# EAGLE design mainboard_200305 (EAGLE 7.7.0)
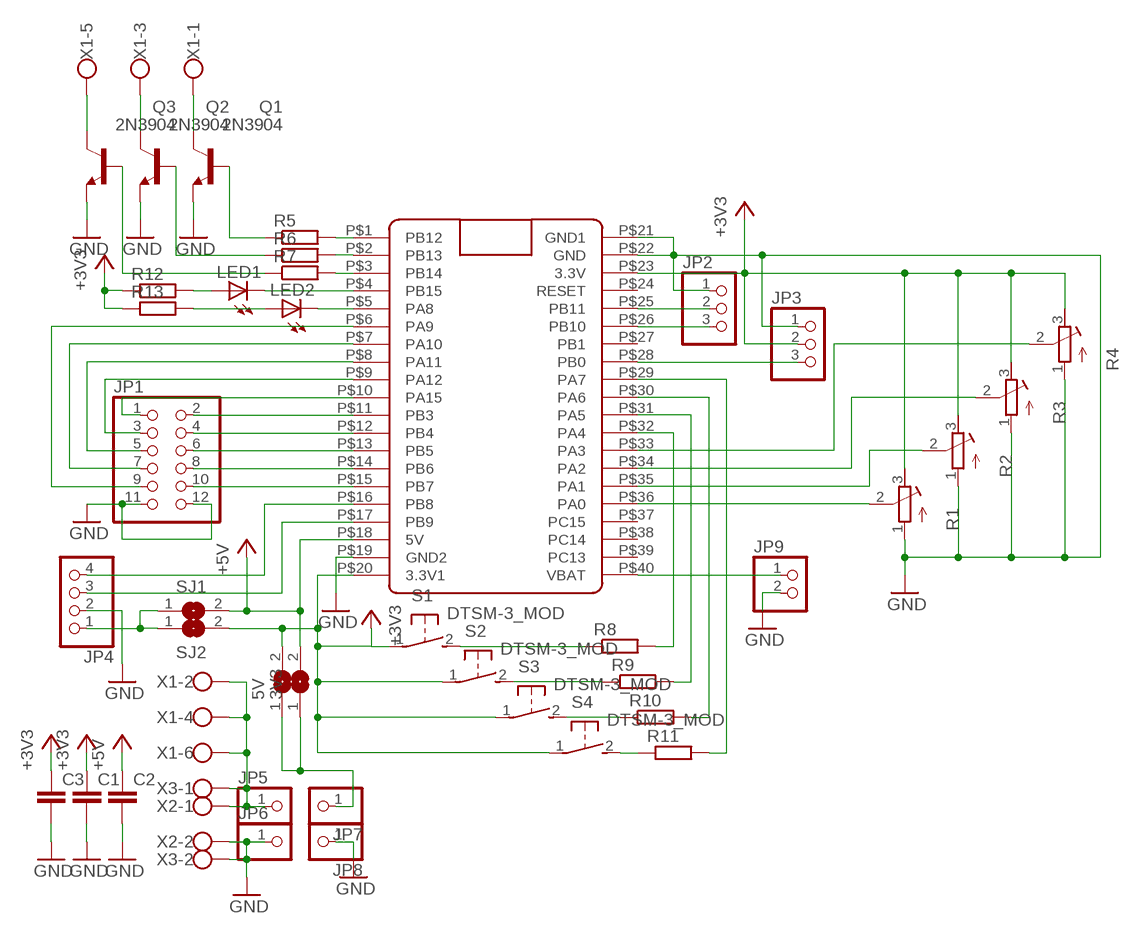
[diagram p0: schematic, sheet 1]

## Parts
3V3  SJ  [SJ]
5V  SJ  [SJ]
C1  C-EU050-045X075  [C050-045X075]
C2  C-EU050-045X075  [C050-045X075]
C3  C-EU050-045X075  [C050-045X075]
JP1  PINHD-2X6  [2X06]
JP2  PINHD-1X3  [1X03]
JP3  PINHD-1X3  [1X03]
JP4  PINHD-1X4  [1X04]
JP5  PINHD-1X1  [1X01]
JP6  PINHD-1X1  [1X01]
JP7  PINHD-1X1  [1X01]
JP8  PINHD-1X1  [1X01]
JP9  PINHD-1X2  [1X02]
LED1  LEDCHIPLED_1206  [CHIPLED_1206]
LED2  LEDCHIPLED_1206  [CHIPLED_1206]
Q1  2N3904  [TO92]
Q2  2N3904  [TO92]
Q3  2N3904  [TO92]
R1  R-TRIMM64W  [RTRIM64W]
R2  R-TRIMM64W  [RTRIM64W]
R3  R-TRIMM64W  [RTRIM64W]
R4  R-TRIMM64W  [RTRIM64W]
R5  R-EU_R1206  [R1206]
R6  R-EU_R1206  [R1206]
R7  R-EU_R1206  [R1206]
R8  R-EU_R1206  [R1206]
R9  R-EU_R1206  [R1206]
R10  R-EU_R1206  [R1206]
R11  R-EU_R1206  [R1206]
R12  R-EU_R1206  [R1206]
R13  R-EU_R1206  [R1206]
S1  DTSM-3_MOD  [DTSM-3_MOD]
S2  DTSM-3_MOD  [DTSM-3_MOD]
S3  DTSM-3_MOD  [DTSM-3_MOD]
S4  DTSM-3_MOD  [DTSM-3_MOD]
SJ1  SJ  [SJ]
SJ2  SJ  [SJ]
U$1  BLUE_PILL  [BLUE_PILL]
X1  W237-6  [W237-6]
X2  W237-102  [W237-102]
X3  W237-102  [W237-102]

## Nets
+3V3: 5V.2 C1.1 C3.1 JP3.2 R1.3(E) R2.3(E) R3.3(E) R4.3(E) R12.1 R13.1 S1.1 S2.1 S3.1 S4.1 SJ2.2 U$1.P$20(3.3V1) U$1.P$23(3.3V)
+5V: 3V3.2 C2.1 SJ1.2 U$1.P$18(5V)
GND: C1.2 C2.2 C3.2 JP1.11 JP1.12 JP2.1 JP3.1 JP4.2 JP6.1 JP8.1 JP9.2 Q1.3(E) Q2.3(E) Q3.3(E) R1.1(A) R2.1(A) R3.1(A) R4.1(A) U$1.P$19(GND2) U$1.P$21(GND1) U$1.P$22(GND) X2.2 X3.2
N$1: R1.2(S) U$1.P$36(PA0)
N$2: R2.2(S) U$1.P$35(PA1)
N$3: R3.2(S) U$1.P$34(PA2)
N$4: R4.2(S) U$1.P$33(PA3)
N$5: JP1.2 U$1.P$11(PB3)
N$6: JP1.4 U$1.P$12(PB4)
N$7: JP1.6 U$1.P$13(PB5)
N$8: Q3.1(C) X1.5
N$9: JP4.1 SJ1.1 SJ2.1
N$10: JP1.8 U$1.P$14(PB6)
N$11: JP1.10 U$1.P$15(PB7)
N$12: JP5.1 X1.2 X1.4 X1.6 X2.1 X3.1
N$13: JP1.1 U$1.P$10(PA15)
N$14: Q2.2(B) R6.1
N$15: Q3.2(B) R7.1
N$16: Q1.2(B) R5.1
N$17: R5.2 U$1.P$1(PB12)
N$18: JP2.3 U$1.P$26(PB10)
N$19: JP2.2 U$1.P$25(PB11)
N$20: Q2.1(C) X1.3
N$21: JP3.3 U$1.P$28(PB0)
N$22: JP4.4 U$1.P$16(PB8)
N$23: JP4.3 U$1.P$17(PB9)
N$24: JP1.3 U$1.P$9(PA12)
N$25: JP1.5 U$1.P$8(PA11)
N$26: JP1.7 U$1.P$7(PA10)
N$27: JP1.9 U$1.P$6(PA9)
N$28: R6.2 U$1.P$2(PB13)
N$29: R7.2 U$1.P$3(PB14)
N$30: R11.1 S4.2
N$31: R8.1 S1.2
N$32: R10.1 S3.2
N$33: R9.1 S2.2
N$34: R8.2 U$1.P$32(PA4)
N$35: R9.2 U$1.P$31(PA5)
N$36: R10.2 U$1.P$30(PA6)
N$37: R11.2 U$1.P$29(PA7)
N$38: Q1.1(C) X1.1
N$39: LED2.A R13.2
N$40: LED2.C U$1.P$5(PA8)
N$41: LED1.C U$1.P$4(PB15)
N$42: LED1.A R12.2
N$43: JP9.1 U$1.P$40(VBAT)
N$44: 3V3.1 5V.1 JP7.1
Unconnected: U$1.P$24(RESET) U$1.P$27(PB1) U$1.P$37(PC15) U$1.P$38(PC14) U$1.P$39(PC13)

## Library data of the parts
3V3 5V SJ1 SJ2 = jumper:SJ: SMD solder JUMPER
C1-C3 = rcl:C-EU: CAPACITOR, European symbol
JP1 = pinhead:PINHD-2X6: PIN HEADER
JP2 JP3 = pinhead:PINHD-1X3: PIN HEADER
JP4 = pinhead:PINHD-1X4: PIN HEADER
JP5-JP8 = pinhead:PINHD-1X1: PIN HEADER
JP9 = pinhead:PINHD-1X2: PIN HEADER
LED1 LED2 = led:LED: LED OSRAM: - CHIPLED LG R971, LG N971, LY N971, LG Q971, LY Q971, LO R971, LY R971 LH N974, LH R974 LS Q976, LO Q976, LY Q976 LO Q996 - Hyper CHIPLED LW Q18S LB Q993, LB Q99A, LB R99A - SideLED LS A670, LO A670, LY A670, LG A670, LP A670 LB A673, LV A673, LT A673, LW A673 LH A674 LY A675 LS A676, LA A676, LO A676, LY A676, LW A676 LS A679, LY A679, LG A679 - Hyper Micro SIDELED® LS Y876, LA Y876, LO Y876, LY Y876 LT Y87S - SmartLED LW L88C, LW L88S LB L89C, LB L89S, LG L890 LS L89K, LO L89K, LY L89K LS L896, LA L896, LO L896, LY L896 - TOPLED LS T670, LO T670, LY T670, LG T670, LP T670 LSG T670, LSP T670, LSY T670, LOP T670, LYG T670 LG T671, LOG T671, LSG T671 LB T673, LV T673, LT T673, LW T673 LH T674 LS T676, LA T676, LO T676, LY T676, LB T676, LH T676, LSB T676, LW T676 LB T67C, LV T67C, LT T67C, LS T67K, LO T67K, LY T67K, LW E67C LS E67B, LA E67B, LO E67B, LY E67B, LB E67C, LV E67C, LT E67C LW T67C LS T679, LY T679, LG T679 LS T770, LO T770, LY T770, LG T770, LP T770 LB T773, LV T773, LT T773, LW T773 LH T774 LS E675, LA E675, LY E675, LS T675 LS T776, LA T776, LO T776, LY T776, LB T776 LHGB T686 LT T68C, LB T68C - Hyper Mini TOPLED® LB M676 - Mini TOPLED Santana® LG M470 LS M47K, LO M47K, LY M47K Source: http://www.osram.convergy.de LUXEON: - LUMILED® LXK2-PW12-R00, LXK2-PW12-S00, LXK2-PW14-U00, LXK2-PW14-V00 LXK2-PM12-R00, LXK2-PM12-S00, LXK2-PM14-U00 LXK2-PE12-Q00, LXK2-PE12-R00, LXK2-PE12-S00, LXK2-PE14-T00, LXK2-PE14-U00 LXK2-PB12-K00, LXK2-PB12-L00, LXK2-PB12-M00, LXK2-PB14-N00, LXK2-PB14-P00, LXK2-PB14-Q00 LXK2-PR12-L00, LXK2-PR12-M00, LXK2-PR14-Q00, LXK2-PR14-R00 LXK2-PD12-Q00, LXK2-PD12-R00, LXK2-PD12-S00 LXK2-PH12-R00, LXK2-PH12-S00 LXK2-PL12-P00, LXK2-PL12-Q00, LXK2-PL12-R00 Source: www.luxeon.com KINGBRIGHT: KA-3528ASYC Source: www.kingbright.com
Q1-Q3 = transistor-npn:2N3904: NPN Transistor
R1-R4 = resistor:R-TRIMM: Trimm resistor
R5-R13 = rcl:R-EU_: RESISTOR, European symbol
S1-S4 = switch-tact_MOD:DTSM-3_MOD
U$1 = BluePill:BLUE_PILL
X1 = con-wago-500:W237-6: WAGO SCREW CLAMP; OC_FARNELL: unknown; OC_NEWARK: unknown
X2 X3 = con-wago-500:W237-102: WAGO SCREW CLAMP; MPN: 237-102; OC_FARNELL: unknown; OC_NEWARK: 70K9898

## Board
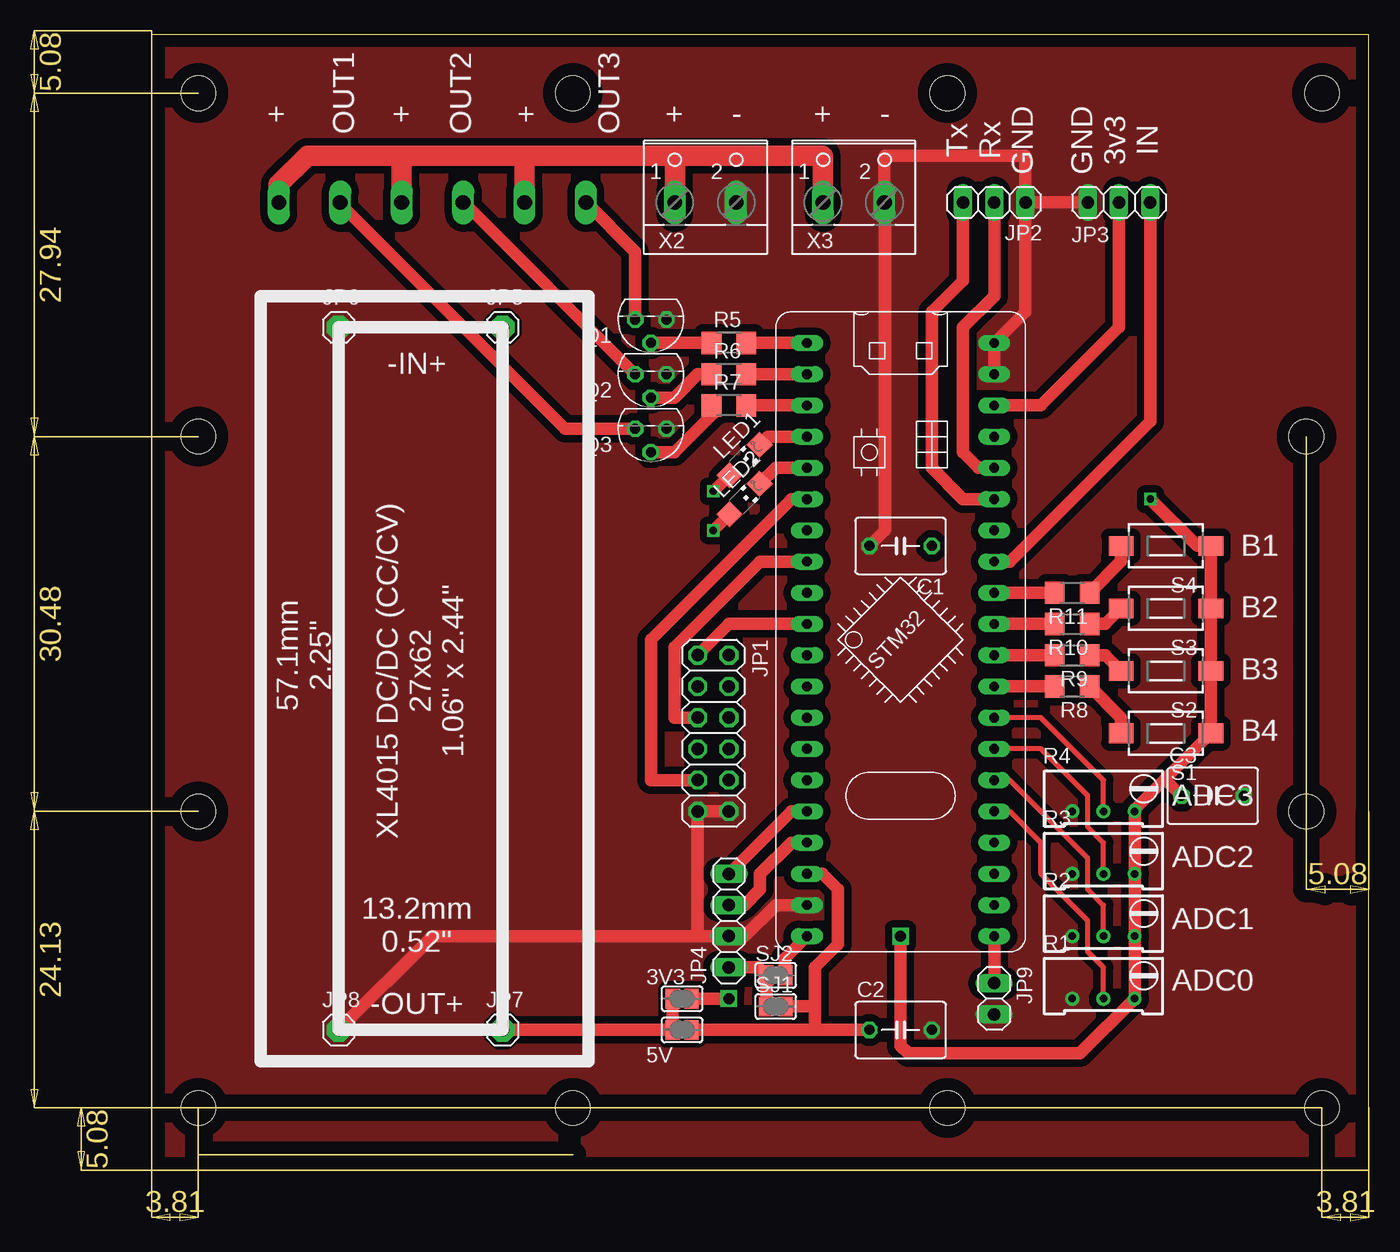
[diagram p1: board, top side]
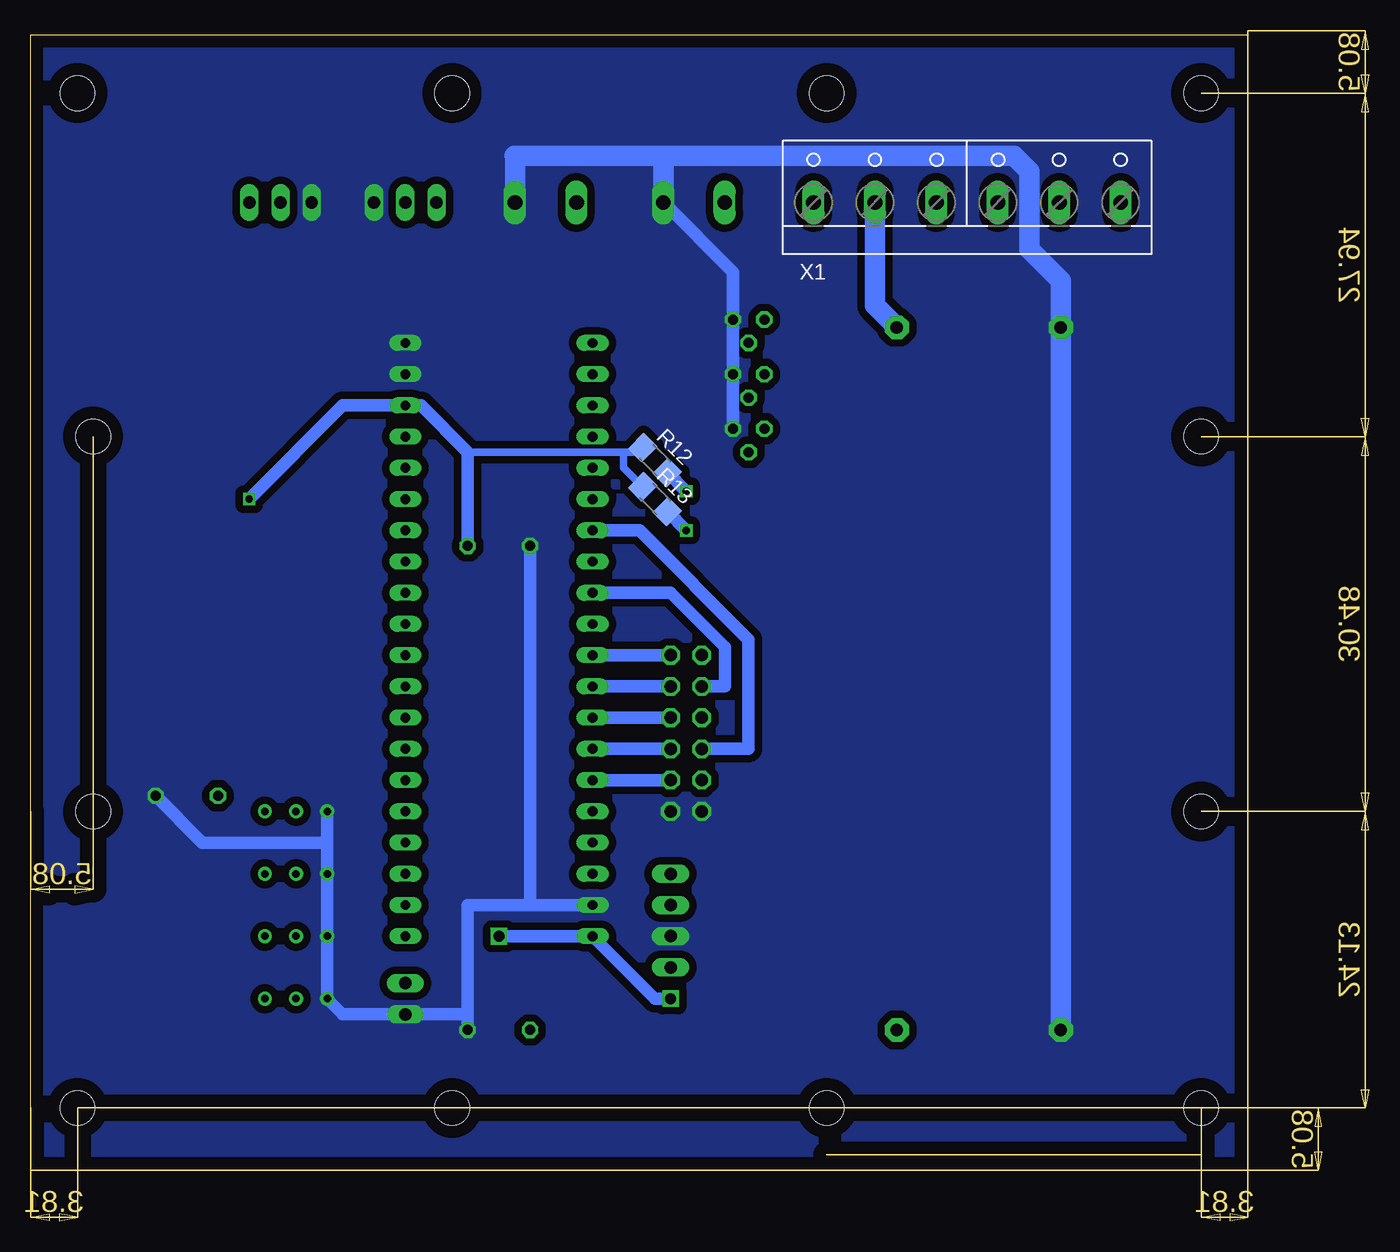
[diagram p2: board, bottom side, seen from below]

Size 99.04 x 92.38 mm. Coordinates in mm from the lower left corner, seen from the top.
Outline: 0,0 99.04,0 99.04,92.38 0,92.38 0,0
Copper layers (1*16): Top 0.035mm / dielectric 1.5mm / Bottom 0.035mm
Design rules "default": minimum track width 10mil, minimum drill 24mil, track to track 8mil, track to pad 8mil, pad to pad 8mil, via to via 8mil, smd to smd 8mil, copper to edge 40mil, drill to drill 8mil, minimum pad ring 10mil, minimum via ring 8mil, stop-mask expansion 4mil, vias tented up to drill 0mil, thermal gap 10mil
Holes 2.8 mm at 64.77,87.63 95.25,87.63 34.29,87.63 3.81,87.63 64.77,5.08 95.25,5.08 34.29,5.08 3.81,5.08 3.81,59.69 3.81,29.21 93.98,59.69 93.98,29.21

### Footprints (pad centres in the part's own frame; a part is rotated, then mirrored left to right if it is on the bottom)
SJ = smd 1.168 x 1.6: 1 -0.762,0; 2 0.762,0
C050-045X075 = drill 0.813 octagon: 1 -2.54,0; 2 2.54,0
2X06 = drill 1.016 octagon: 1 -6.35,-1.27; 2 -6.35,1.27; 3 -3.81,-1.27; 4 -3.81,1.27; 5 -1.27,-1.27; 6 -1.27,1.27; 7 1.27,-1.27; 8 1.27,1.27; 9 3.81,-1.27; 10 3.81,1.27; 11 6.35,-1.27; 12 6.35,1.27
1X03 = drill 1.016 long: 1 -2.54,0; 2 0,0; 3 2.54,0
1X04 = drill 1.016 long: 1 -3.81,0; 2 -1.27,0; 3 1.27,0; 4 3.81,0
1X01 = drill 1.016 pad 1.93 octagon: 1 0,0
1X02 = drill 1.016 long: 1 -1.27,0; 2 1.27,0
CHIPLED_1206 = smd 1.5 x 1.5: A 0,-1.75; C 0,1.75
TO92 = drill 0.813 octagon: 1 1.27,0; 2 0,1.905; 3 -1.27,0
RTRIM64W = drill 0.61: 1 1.27,-2.54; 2 1.27,0; 3 1.27,2.54
R1206 = smd 1.6 x 1.803: 1 -1.422,0; 2 1.422,0
DTSM-3_MOD = smd 2 x 1.6: 1 -3.652,0; 2 3.652,0
BLUE_PILL = drill 0.8 long: P$1 -7.62,15.24; P$2 -7.62,12.7; P$3 -7.62,10.16; P$4 -7.62,7.62; P$5 -7.62,5.08; P$6 -7.62,2.54; P$7 -7.62,0; P$8 -7.62,-2.54; P$9 -7.62,-5.08; P$10 -7.62,-7.62; P$11 -7.62,-10.16; P$12 -7.62,-12.7; P$13 -7.62,-15.24; P$14 -7.62,-17.78; P$15 -7.62,-20.32; P$16 -7.62,-22.86; P$17 -7.62,-25.4; P$18 -7.62,-27.94; P$19 -7.62,-30.48; P$20 -7.62,-33.02; P$21 7.62,15.24; P$22 7.62,12.7; P$23 7.62,10.16; P$24 7.62,7.62; P$25 7.62,5.08; P$26 7.62,2.54; P$27 7.62,0; P$28 7.62,-2.54; P$29 7.62,-5.08; P$30 7.62,-7.62; P$31 7.62,-10.16; P$32 7.62,-12.7; P$33 7.62,-15.24; P$34 7.62,-17.78; P$35 7.62,-20.32; P$36 7.62,-22.86; P$37 7.62,-25.4; P$38 7.62,-27.94; P$39 7.62,-30.48; P$40 7.62,-33.02
W237-6 = drill 1.194 long: 1 -12.5,-1.27; 2 -7.5,-1.27; 3 -2.5,-1.27; 4 2.5,-1.27; 5 7.5,-1.27; 6 12.5,-1.27
W237-102 = drill 1.194 long: 1 -2.5,-1.27; 2 2.5,-1.27

### Placement (x,y rotation side)
3V3  43.18,11.43 0 top
5V  43.18,13.97 0 top
C1  60.96,50.8 180 top
C2  60.96,11.43 0 top
C3  86.36,30.48 0 top
JP1  45.72,35.56 270 top
JP2  68.58,78.74 180 top
JP3  78.74,78.74 0 top
JP4  46.99,20.32 90 top
JP5  28.57,68.58 0 top
JP6  15.24,68.58 0 top
JP7  28.57,11.43 0 top
JP8  15.24,11.43 0 top
JP9  68.58,13.97 270 top
LED1  48.26,57.78 315 top
LED2  48.26,54.61 315 top
Q1  40.64,69.22 180 top
Q2  40.64,64.77 180 top
Q3  40.64,60.33 180 top
R1  77.47,15.24 270 top
R2  77.47,20.32 270 top
R3  77.47,25.4 270 top
R4  77.47,30.48 270 top
R5  46.99,67.31 0 top
R6  46.99,64.77 0 top
R7  46.99,62.23 0 top
R8  74.93,39.37 180 top
R9  74.93,41.91 180 top
R10  74.93,44.45 180 top
R11  74.93,46.99 180 top
R12  48.26,57.78 315 bottom
R13  48.26,54.61 315 bottom
S1  82.55,35.56 180 top
S2  82.55,40.64 180 top
S3  82.55,45.72 180 top
S4  82.55,50.8 180 top
SJ1  50.8,13.34 0 top
SJ2  50.8,15.88 0 top
U$1  60.96,52.07 0 top
X1  22.86,80.01 0 bottom
X2  45.09,80.01 0 top
X3  57.15,80.01 0 top

### Tracks (layer width: path | path; a pad name or v marks a point on that pad's centre or on a via)
+3V3  (via drill 0.6, 0.9)
  Top 1.016: SJ2.2 51.56,17.27 U$1.P$20 | 82.47,31.83 80.01,29.37 R4.3 R3.3 R2.3 R1.3 75.56,9.53 61.59,9.53 60.96,10.16 v60.96,19.05 | 82.47,31.83 S1.1 S2.1 S3.1 S4.1 85.09,50.8 v81.28,54.61 | C3.1 82.47,31.83 | 5V.2 v46.99,13.97 | U$1.P$23 72.39,62.23 78.74,68.58 JP3.2
  Bottom 0.61: 63.5,58.42 50.8,58.42 | 50.8,58.42 49.64,58.42 R12.1 | R13.1 50.8,57.15 50.8,58.42
  Bottom 1.016: v46.99,13.97 48.26,13.97 U$1.P$20 v60.96,19.05 | v81.28,54.61 73.66,62.23 U$1.P$23 67.31,62.23 63.5,58.42 C1.1
+5V
  Top 1.016: U$1.P$18 54.61,24.13 55.88,22.86 55.88,18.41 53.98,16.51 53.98,13.34 | 53.98,13.34 SJ1.2 | 3V3.2 53.98,11.43 | 53.98,11.43 53.98,13.34 | C2.1 53.98,11.43
GND
  Top 1.016: U$1.P$19 50.8,21.59 48.26,19.05 JP4.2 44.45,19.05 | 44.45,19.05 22.86,19.05 JP8.1 | JP1.12 JP1.11 44.45,19.05 | JP3.1 JP2.1 | U$1.P$22 U$1.P$21 71.12,69.85 JP2.1 | X3.2 59.65,82.51 59.69,82.55 71.12,82.55 JP2.1 | 59.69,78.74 59.69,52.07 C1.2
  Bottom 1.016: 74.93,26.67 R3.1 R2.1 R1.1 73.66,12.7 JP9.2 63.5,12.7 | 74.93,26.67 R4.1 | C3.2 85.09,26.67 74.93,26.67 | Q3.3 Q2.3 Q1.3 41.91,73.06 X2.2 | C1.2 58.42,21.59 | 58.42,21.59 U$1.P$19 | C2.2 63.5,12.7 | 58.42,21.59 63.5,21.59 63.5,12.7
  Bottom 1.676: 47.59,82.55 19.05,82.55 17.78,81.28 17.78,74.93 15.24,72.39 JP6.1 JP8.1 | 47.59,82.55 X2.2 | X3.2 59.65,82.51 59.69,82.55 47.59,82.55
  pour Top (isolate 0.61, no thermals): 0,92.71 99.06,92.71 99.06,0 0,0
  pour Bottom (isolate 0.61, no thermals): 0,92.71 0,0 99.06,0 99.06,92.71
N$1
  Top 0.406: R1.2 77.47,16.51 76.2,17.78 76.2,20.32 72.39,24.13 72.39,26.67 69.85,29.21 U$1.P$36
N$2
  Top 0.406: R2.2 77.47,21.59 76.2,22.86 76.2,25.4 69.85,31.75 U$1.P$35
N$3
  Top 0.406: R3.2 77.47,26.67 76.2,27.94 76.2,30.48 72.39,34.29 U$1.P$34
N$4
  Top 0.406: R4.2 77.47,31.75 72.39,36.83 U$1.P$33
N$5
  Bottom 1.016: U$1.P$11 JP1.2
N$6
  Bottom 1.016: U$1.P$12 JP1.4
N$7
  Bottom 1.016: U$1.P$13 JP1.6
N$8
  Top 1.016: X1.5 15.36,78.62 33.66,60.33 Q3.1
N$9
  Top 1.016: JP4.1 49.4,16.51 SJ2.1 SJ1.1
N$10
  Bottom 1.016: U$1.P$14 JP1.8
N$11
  Bottom 1.016: U$1.P$15 JP1.10
N$12
  Top 1.676: X1.6 10.36,80.21 12.7,82.55 20.32,82.55 | 20.32,82.55 30.48,82.55 | 30.48,82.55 42.59,82.55 | 42.59,82.55 X2.1 | X1.4 20.36,82.51 20.32,82.55 | X1.2 30.36,82.43 30.48,82.55 | X3.1 54.65,82.51 54.61,82.55 42.59,82.55
  Bottom 1.676: X1.2 30.36,70.36 JP5.1
N$13
  Top 1.016: U$1.P$10 46.99,44.45 JP1.1
N$14
  Top 1.016: Q2.2 42.55,62.87 44.45,64.77 R6.1
N$15
  Top 1.016: Q3.2 42.55,58.42 45.72,61.59 45.72,62.08 R7.1
N$16
  Top 1.016: Q1.2 R5.1
N$17
  Top 1.016: U$1.P$1 R5.2
N$18
  Top 1.016: U$1.P$26 66.04,54.61 63.5,57.15 63.5,69.85 66.04,72.39 JP2.3
N$19
  Top 1.016: U$1.P$25 67.31,57.15 66.04,58.42 66.04,68.58 68.58,71.12 JP2.2
N$20
  Top 1.016: X1.3 25.4,78.74 Q2.1
N$21
  Top 1.016: JP3.3 81.28,60.96 69.85,49.53 U$1.P$28
N$22
  Top 1.016: U$1.P$16 52.07,29.21 JP4.4
N$23
  Top 1.016: U$1.P$17 52.07,26.67 49.53,24.13 49.53,22.86 48.26,21.59 JP4.3
N$24
  Bottom 1.016: JP1.3 42.55,39.37 42.55,42.55 46.99,46.99 U$1.P$9
N$25
  Top 1.016: JP1.5 42.55,36.83 42.55,42.55 49.53,49.53 U$1.P$8
N$26
  Bottom 1.016: JP1.7 40.64,34.29 40.64,43.18 49.53,52.07 U$1.P$7
N$27
  Top 1.016: JP1.9 40.64,31.75 40.64,43.18 52.07,54.61 U$1.P$6
N$28
  Top 1.016: R6.2 U$1.P$2
N$29
  Top 1.016: R7.2 U$1.P$3
N$30
  Top 1.016: S4.2 78.9,49.53 R11.1
N$31
  Top 1.016: S1.2 78.9,36.83 R8.1
N$32
  Top 1.016: R10.1 77.63,44.45 S3.2
N$33
  Top 1.016: R9.1 77.63,41.91 S2.2
N$34
  Top 1.016: U$1.P$32 R8.2
N$35
  Top 1.016: U$1.P$31 R9.2
N$36
  Top 1.016: U$1.P$30 R10.2
N$37
  Top 1.016: U$1.P$29 R11.2
N$38
  Top 1.016: Q1.1 39.37,74.73 X1.1
N$39  (via drill 0.6)
  Top 1.016: LED2.A v45.72,52.07
  Bottom 1.016: v45.72,52.07 R13.2
N$40
  Top 1.016: U$1.P$5 50.8,57.15 LED2.C
N$41
  Top 1.016: U$1.P$4 50.16,59.69 LED1.C
N$42  (via drill 0.6)
  Top 1.016: v45.72,55.24 LED1.A
  Bottom 1.016: v45.72,55.24 R12.2
N$43
  Top 1.016: JP9.1 U$1.P$40
N$44
  Top 1.016: JP7.1 41.91,11.43 | 41.91,11.43 3V3.1 | 5V.1 42.42,11.94 41.91,11.43

### Text on the board
tPlace: OUT1 | OUT2 | OUT3 | + | + | + | + | - | + | - | Tx / Rx / GND | GND / 3v3 / IN | -IN+ | 57.1mm / 2.25" | XL4015 DC/DC (CC/CV) / 27x62 / 1.06" x 2.44" | B1 / B2 / B3 / B4 | 13.2mm / 0.52" | ADC3 / ADC2 / ADC1 / ADC0 | -OUT+